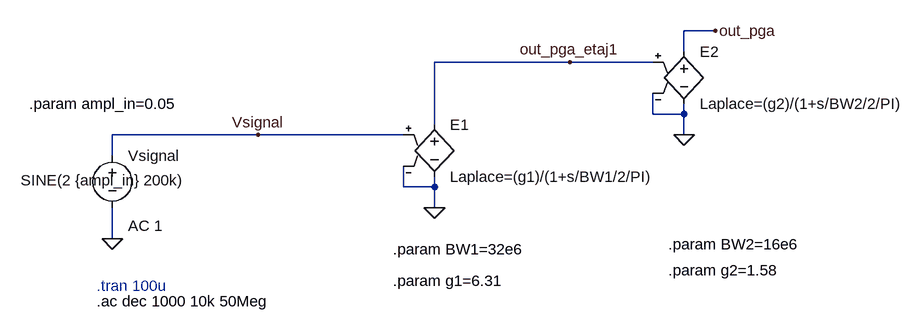
[diagram p0: schematic model_PGA_Gm_2etaje.asc]
model_PGA_Gm_2etaje.asc, the LTspice schematic file:
Version 4
SHEET 1 3256 1736
WIRE 2704 160 2656 160
WIRE 2656 192 2656 160
WIRE 2480 208 2272 208
WIRE 2608 208 2480 208
WIRE 2608 288 2608 256
WIRE 2656 288 2656 272
WIRE 2656 288 2608 288
WIRE 2272 304 2272 208
WIRE 2000 320 1776 320
WIRE 2224 320 2000 320
WIRE 2656 320 2656 288
WIRE 1776 352 1776 320
WIRE 2224 400 2224 368
WIRE 2272 400 2272 384
WIRE 2272 400 2224 400
WIRE 2272 432 2272 400
WIRE 1776 480 1776 432
FLAG 1776 480 0
FLAG 2000 320 Vsignal
FLAG 2272 432 0
FLAG 2480 208 out_pga_etaj1
FLAG 2656 320 0
FLAG 2704 160 out_pga
SYMBOL voltage 1776 336 R0
WINDOW 123 24 124 Left 2
WINDOW 39 0 0 Left 0
WINDOW 3 -141 54 Left 2
SYMATTR Value2 AC 1
SYMATTR Value SINE(2 {ampl_in} 200k)
SYMATTR InstName Vsignal
SYMBOL e 2272 288 R0
SYMATTR InstName E1
SYMATTR Value Laplace=(g1)/(1+s/BW1/2/PI)
SYMBOL e 2656 176 R0
SYMATTR InstName E2
SYMATTR Value Laplace=(g2)/(1+s/BW2/2/PI)
TEXT 1752 576 Left 2 !.ac dec 1000 10k 50Meg
TEXT 1752 552 Left 2 ;.tran 100u
TEXT 1648 272 Left 2 !.param ampl_in=0.05
TEXT 2208 496 Left 2 !.param BW1=32e6
TEXT 2208 544 Left 2 !.param g1=6.31
TEXT 2632 528 Left 2 !.param g2=1.58
TEXT 2632 488 Left 2 !.param BW2=16e6

The netlist it stands for:
* model_PGA_Gm_2etaje.asc
Vsignal Vsignal 0 SINE(2 {ampl_in} 200k) AC 1
E1 out_pga_etaj1 0 Vsignal 0 Laplace=(g1)/(1+s/BW1/2/PI)
E2 out_pga 0 out_pga_etaj1 0 Laplace=(g2)/(1+s/BW2/2/PI)
.ac dec 1000 10k 50Meg
* .tran 100u
.param ampl_in=0.05
.param BW1=32e6
.param g1=6.31
.param g2=1.58
.param BW2=16e6
.backanno
.end